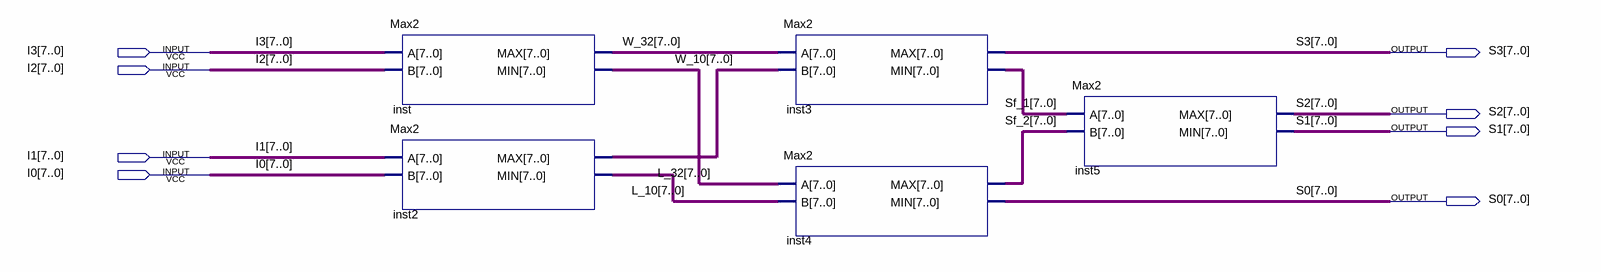
[diagram p0: schematic sheet]
// Quartus schematic Ordenador.bdf as structural Verilog: 5 symbols, 8 pins
module Ordenador (
  input  [7:0] I3,
  input  [7:0] I2,
  input  [7:0] I1,
  input  [7:0] I0,
  output [7:0] S3,
  output [7:0] S2,
  output [7:0] S1,
  output [7:0] S0
);

  wire [7:0] L_10, L_32, Sf_1, Sf_2, W_10, W_32;

  Max2 inst (.A(I3), .B(I2), .MAX(W_32), .MIN(L_32));
  Max2 inst2 (.A(I1), .B(I0), .MAX(W_10), .MIN(L_10));
  Max2 inst3 (.A(W_32), .B(W_10), .MAX(S3), .MIN(Sf_1));
  Max2 inst4 (.A(L_32), .B(L_10), .MAX(Sf_2), .MIN(S0));
  Max2 inst5 (.A(Sf_1), .B(Sf_2), .MAX(S2), .MIN(S1));
endmodule
